# EasyEDA schematic ws2812-cube-v1.2.json
TITLE: Sheet_1; REV: 1.0; Date: 2020-08-09; Sheet: 1/1; Drawn By: gcrisis; Company: Your Company
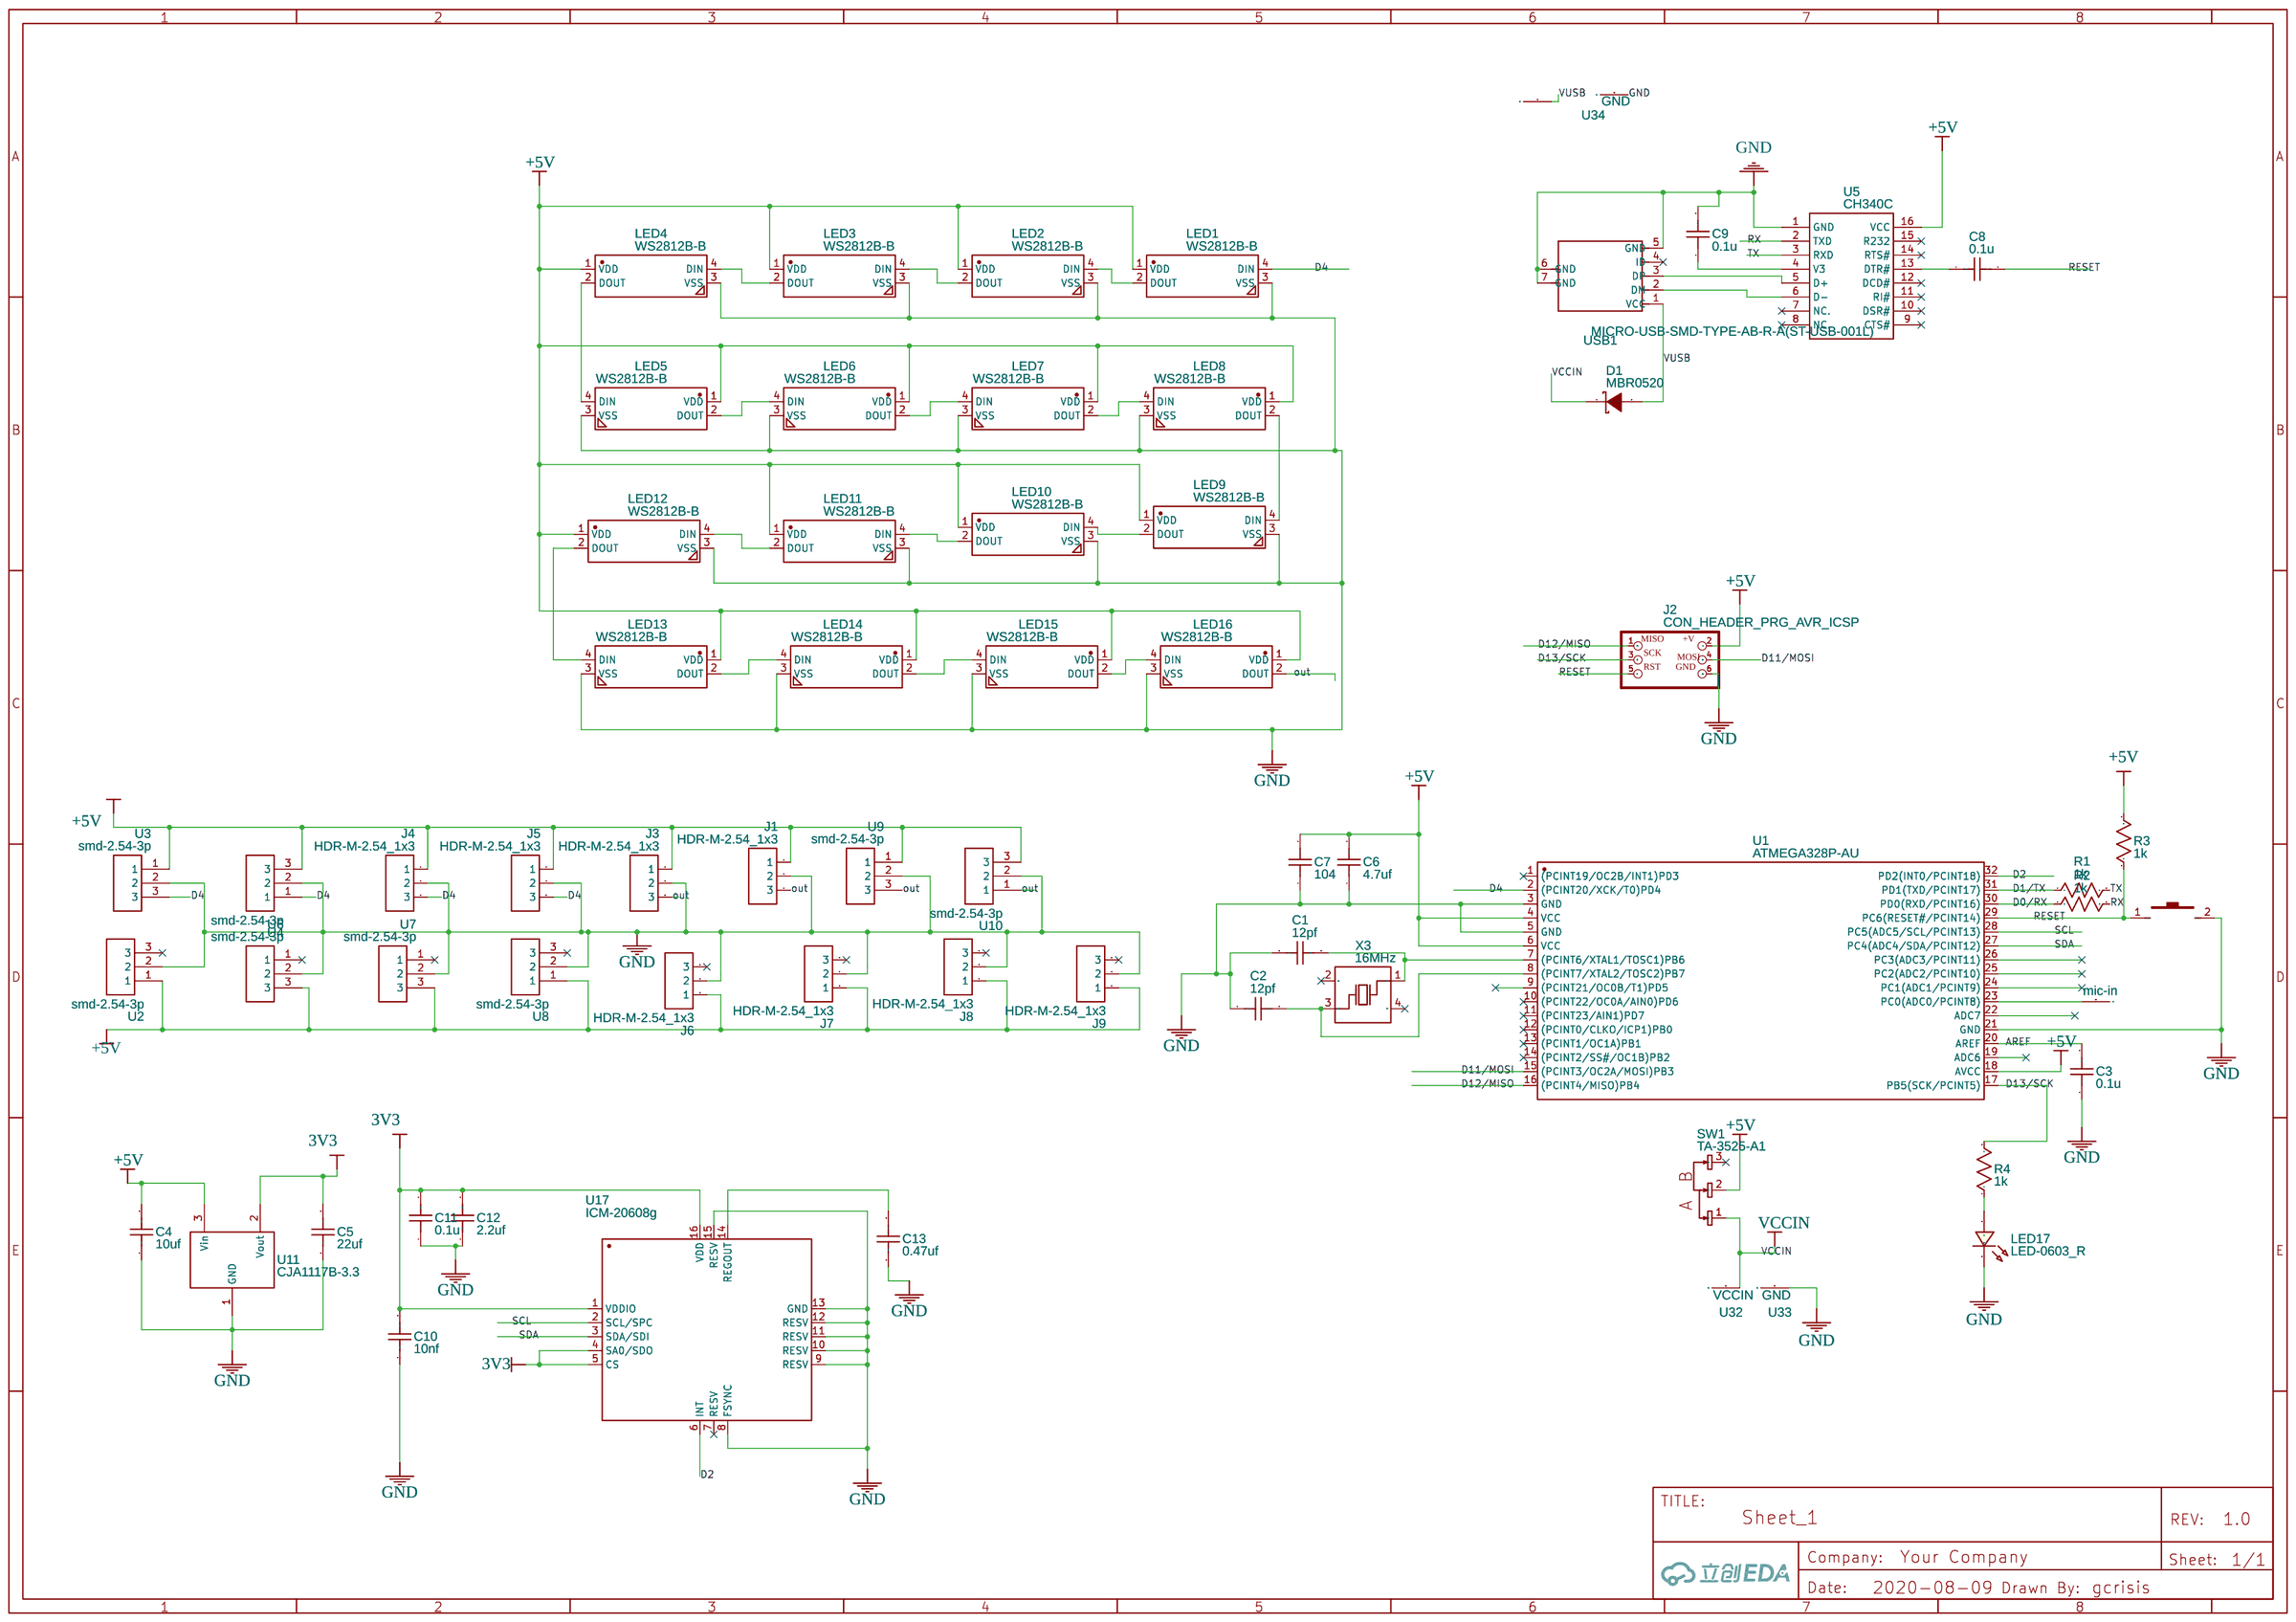
[diagram p0: schematic sheet]

## Parts
C1  12pf  [C0603]
C2  12pf  [C0603]
C3  0.1u  [C0603]
C4  10uf  [C0603]
C5  22uf  [C0603]
C6  4.7uf  [C0603]
C7  104  [C0603]
C8  0.1u  [C0603]
C9  0.1u  [C0603]
C10  10nf  [C0603]
C11  0.1u  [C0603]
C12  2.2uf  [C0603]
C13  0.47uf  [C0603]
D1  MBR0520  [SOD-123_L2.8-W1.8-LS3.7-RD]
J1  HDR-M-2.54_1x3  [HDR-M-2.54_1X3]
J2  CON_HEADER_PRG_AVR_ICSP  [M2X3_SMD]
J3  HDR-M-2.54_1x3  [HDR-M-2.54_1X3]
J4  HDR-M-2.54_1x3  [HDR-M-2.54_1X3]
J5  HDR-M-2.54_1x3  [HDR-M-2.54_1X3]
J6  HDR-M-2.54_1x3  [HDR-M-2.54_1X3]
J7  HDR-M-2.54_1x3  [HDR-M-2.54_1X3]
J8  HDR-M-2.54_1x3  [HDR-M-2.54_1X3]
J9  HDR-M-2.54_1x3  [HDR-M-2.54_1X3]
KEY1  3x6x2.5mm  [KEY-3.0*6.0]
LED1  WS2812B-B  [LED-SMD_4P-L5.0-W5.0-TL_WS2812B-B]
LED2  WS2812B-B  [LED-SMD_4P-L5.0-W5.0-TL_WS2812B-B]
LED3  WS2812B-B  [LED-SMD_4P-L5.0-W5.0-TL_WS2812B-B]
LED4  WS2812B-B  [LED-SMD_4P-L5.0-W5.0-TL_WS2812B-B]
LED5  WS2812B-B  [LED-SMD_4P-L5.0-W5.0-TL_WS2812B-B]
LED6  WS2812B-B  [LED-SMD_4P-L5.0-W5.0-TL_WS2812B-B]
LED7  WS2812B-B  [LED-SMD_4P-L5.0-W5.0-TL_WS2812B-B]
LED8  WS2812B-B  [LED-SMD_4P-L5.0-W5.0-TL_WS2812B-B]
LED9  WS2812B-B  [LED-SMD_4P-L5.0-W5.0-TL_WS2812B-B]
LED10  WS2812B-B  [LED-SMD_4P-L5.0-W5.0-TL_WS2812B-B]
LED11  WS2812B-B  [LED-SMD_4P-L5.0-W5.0-TL_WS2812B-B]
LED12  WS2812B-B  [LED-SMD_4P-L5.0-W5.0-TL_WS2812B-B]
LED13  WS2812B-B  [LED-SMD_4P-L5.0-W5.0-TL_WS2812B-B]
LED14  WS2812B-B  [LED-SMD_4P-L5.0-W5.0-TL_WS2812B-B]
LED15  WS2812B-B  [LED-SMD_4P-L5.0-W5.0-TL_WS2812B-B]
LED16  WS2812B-B  [LED-SMD_4P-L5.0-W5.0-TL_WS2812B-B]
LED17  LED-0603_R  [LED0603_RED]
R1  1k  [R0603]
R2  1k  [R0603]
R3  1k  [R0603]
R4  1k  [R0603]
SW1  TA-3525-A1  [SW-SMD_3P-L9.1-W3.5-P2.50-EH6.8]
U1  ATMEGA328P-AU  [TQFP-32_L7.0-W7.0-P0.80-LS9.0-BL]
U2  smd-2.54-3p  [SMD-2.54-3P]
U3  smd-2.54-3p  [SMD-2.54-3P]
U4  smd-2.54-3p  [SMD-2.54-3P]
U5  CH340C  [SOP-16_L10.0-W3.9-P1.27-LS6.0-BL]
U6  smd-2.54-3p  [SMD-2.54-3P]
U7  smd-2.54-3p  [SMD-2.54-3P]
U8  smd-2.54-3p  [SMD-2.54-3P]
U9  smd-2.54-3p  [SMD-2.54-3P]
U10  smd-2.54-3p  [SMD-2.54-3P]
U11  CJA1117B-3.3  [SOT-89-3_L4.5-W2.5-P1.50-LS4.2-BR]
U12  mic-in  [PAD-100X55-RRECT]
U17  ICM-20608g  [LGA-16_L3.0-W3.0-P0.50-BL]
U32  VCCIN  [PAD-100X55-RRECT]
U33  GND  [PAD-100X55-RRECT]
U34  GND  [PAD-100X55-RRECT]
U35  VUSB  [PAD-100X55-RRECT]
USB1  MICRO-USB-SMD-TYPE-AB-R-A(ST-USB-001L)  [MICRO-USB5+2P-SMD-0.65]
X3  16MHz  [OSC-SMD_4P-L3.2-W2.5-BL]

## Library data of the parts
C1-C13 = C_0603_US: Contributor: LCEDA_Lib
D1 = MBR0520: Supplier: LCSC; Manufacturer: CJ; image: //image.lceda.cn/szlcsc/C77335.jpg; Supplier Part: C77335; LCSC Assembly: Yes; SMT Type: Extend
J1 J3-J9 = HDR-M-2.54_1x3: Supplier Part: C180248; Supplier: LCSC; Contributor: LCEDA_Lib
J2 = CON_HEADER_PRG_AVR_ICSP: Contributor: DangerousPrototype
KEY1 = 3x6x2.5mm: Supplier Part: C5382; Supplier: LCSC; Manufacturer: ReliaPro
LED1-LED16 = WS2812B-B: Supplier: LCSC; Manufacturer: Worldsemi; Contributor: LCSC; Supplier Part: C114586; LCSC Assembly: Yes; SMT Type: Extend
LED17 = LED-0603_R: Manufacturer: EVERLIGHT(台湾亿光); Manufacturer Part: 19-217/R6C-AL1M2VY/3T; Supplier Part: C72044; Supplier: LCSC; Contributor: LCEDA_01
R1-R4 = R_0603_US: Contributor: LCEDA_Lib
SW1 = TA-3525-A1: Supplier: LCSC; Supplier Part: C514018; Manufacturer: Yuandi; Contributor: LCSC
U1 = ATMEGA328P-AU: Supplier: LCSC; Manufacturer: MICROCHIP; image: //image.lceda.cn/szlcsc/C14877.jpg; Supplier Part: C14877; LCSC Assembly: Yes; SMT Type: Basic
U2-U4 U6-U10 = smd-2.54-3p: Contributor: gcrisis
U5 = CH340C: Supplier: LCSC; Manufacturer: WCH; Supplier Part: C84681; LCSC Assembly: Yes; SMT Type: Extend
U11 = CJA1117B-3.3: Supplier: LCSC; Manufacturer: CJ; image: //image.lceda.cn/szlcsc/C24253.jpg; Supplier Part: C24253; LCSC Assembly: Yes; SMT Type: Extend
U12 U32-U35 = PAD: Contributor: Pinoccio
U17 = ICM-20602: Supplier: LCSC; Supplier Part: C97633; Manufacturer: TDK InvenSense; Contributor: LCSC; LCSC Assembly: Yes; SMT Type: Extend
USB1 = MICRO-USB-SMD-TYPE-AB-R-A(ST-USB-001L): Manufacturer Part: ?
X3 = X1E0000210375000G: Supplier: LCSC; Manufacturer: EPSON; Contributor: LCSC; Supplier Part: C89379; LCSC Assembly: Yes; SMT Type: Extend

## Nets
3V3: C5.2 C10.2 C11.2 C12.2 U11.2(Vout) U17.1(VDDIO) U17.4(SA0/SDO) U17.5(CS) U17.16(VDD)
+5V: C4.2 C6.2 C7.2 J1.1 J2.2(+V) J3.1 J4.1 J5.1 J6.1 J7.1 J8.1 J9.1 LED1.1(VDD) LED2.1(VDD) LED3.1(VDD) LED4.1(VDD) LED5.1(VDD) LED6.1(VDD) LED7.1(VDD) LED8.1(VDD) LED9.1(VDD) LED10.1(VDD) LED11.1(VDD) LED12.1(VDD) LED13.1(VDD) LED14.1(VDD) LED15.1(VDD) LED16.1(VDD) R3.2 SW1.2 U1.4(VCC) U1.6(VCC) U1.18(AVCC) U2.1 U3.1 U4.3 U5.16(VCC) U6.3 U7.3 U8.1 U9.1 U10.3 U11.3(Vin)
GND: C1.1 C2.1 C3.1 C4.1 C5.1 C6.1 C7.1 C9.2 C10.1 C11.1 C12.1 C13.1 J1.2 J2.6(GND) J3.2 J4.2 J5.2 J6.2 J7.2 J8.2 J9.2 KEY1.2 LED1.3(VSS) LED2.3(VSS) LED3.3(VSS) LED4.3(VSS) LED5.3(VSS) LED6.3(VSS) LED7.3(VSS) LED8.3(VSS) LED9.3(VSS) LED10.3(VSS) LED11.3(VSS) LED12.3(VSS) LED13.3(VSS) LED14.3(VSS) LED15.3(VSS) LED16.3(VSS) LED17.2 U1.3(GND) U1.5(GND) U1.21(GND) U2.2 U3.2 U4.2 U5.1(GND) U6.2 U7.2 U8.2 U9.2 U10.2 U11.1(GND) U17.8(FSYNC) U17.9(RESV) U17.10(RESV) U17.11(RESV) U17.12(RESV) U17.13(GND) U17.15(RESV) U33.P$1 U34.P$1 USB1.5(GND) USB1.6(GND) USB1.7(GND)
VCCIN: D1.1(K) SW1.1 U32.P$1
AREF: C3.2 U1.20(AREF)
D0/RX: R2.1 U1.30(PD0(RXD/PCINT16))
D1/TX: R1.1 U1.31(PD1(TXD/PCINT17))
D2: U1.32(PD2(INT0/PCINT18)) U17.6(INT)
D4: J4.3 J5.3 LED1.4(DIN) U1.2((PCINT20/XCK/T0)PD4) U3.3 U4.1
D11/MOSI: J2.4(MOSI) U1.15((PCINT3/OC2A/MOSI)PB3)
D12/MISO: J2.1(MISO) U1.16((PCINT4/MISO)PB4)
D13/SCK: J2.3(SCK) R4.2 U1.17(PB5(SCK/PCINT5))
out: J1.3 J3.3 LED16.2(DOUT) U9.3 U10.1
RESET: C8.2 J2.5(RST) KEY1.1 R3.1 U1.29(PC6(RESET#/PCINT14))
RX: R2.2 U5.2(TXD)
SCL: U1.28(PC5(ADC5/SCL/PCINT13)) U17.2(SCL/SPC)
SDA: U1.27(PC4(ADC4/SDA/PCINT12)) U17.3(SDA/SDI)
TX: R1.2 U5.3(RXD)
VUSB: D1.2(A) U35.P$1 USB1.1(VCC)
Net-(C1-2): C1.2 U1.7((PCINT6/XTAL1/TOSC1)PB6) X3.1(OSC1)
Net-(C2-2): C2.2 U1.8((PCINT7/XTAL2/TOSC2)PB7) X3.3(OSC2)
Net-(C8-1): C8.1 U5.13(DTR#)
Net-(C9-1): C9.1 U5.4(V3)
Net-(C13-2): C13.2 U17.14(REGOUT)
Net-(LED1-2): LED1.2(DOUT) LED2.4(DIN)
Net-(LED2-2): LED2.2(DOUT) LED3.4(DIN)
Net-(LED3-2): LED3.2(DOUT) LED4.4(DIN)
Net-(LED4-2): LED4.2(DOUT) LED5.4(DIN)
Net-(LED5-2): LED5.2(DOUT) LED6.4(DIN)
Net-(LED6-2): LED6.2(DOUT) LED7.4(DIN)
Net-(LED7-2): LED7.2(DOUT) LED8.4(DIN)
Net-(LED8-2): LED8.2(DOUT) LED9.4(DIN)
Net-(LED9-2): LED9.2(DOUT) LED10.4(DIN)
Net-(LED10-2): LED10.2(DOUT) LED11.4(DIN)
Net-(LED11-2): LED11.2(DOUT) LED12.4(DIN)
Net-(LED12-2): LED12.2(DOUT) LED13.4(DIN)
Net-(LED13-2): LED13.2(DOUT) LED14.4(DIN)
Net-(LED14-2): LED14.2(DOUT) LED15.4(DIN)
Net-(LED15-2): LED15.2(DOUT) LED16.4(DIN)
Net-(LED17-1): LED17.1 R4.1
Net-(U1-23): U1.23(PC0(ADC0/PCINT8)) U12.P$1
Net-(U5-5): U5.5(D+) USB1.3(DP)
Net-(U5-6): U5.6(D-) USB1.2(DM)

Not connected (* = marked no-connect by the designer): J6 3*; J7 3*; J8 3*; J9 3*; SW1 3*; U1 1((PCINT19/OC2B/INT1)PD3)* 9((PCINT21/OC0B/T1)PD5) 10((PCINT22/OC0A/AIN0)PD6)* 11((PCINT23/AIN1)PD7)* 12((PCINT0/CLKO/ICP1)PB0)* 13((PCINT1/OC1A)PB1)* 14((PCINT2/SS#/OC1B)PB2)* 19(ADC6) 22(ADC7) 24(PC1(ADC1/PCINT9)) 25(PC2(ADC2/PCINT10)) 26(PC3(ADC3/PCINT11)); U2 3*; U5 7(NC.)* 8(NC.)* 9(CTS#)* 10(DSR#)* 11(RI#)* 12(DCD#)* 14(RTS#)* 15(R232)*; U6 1*; U7 1*; U8 3*; U17 7(RESV)*; USB1 4(ID)*; X3 2(GND)* 4(GND)*
